# EAGLE design zap (EAGLE 6.6.0)
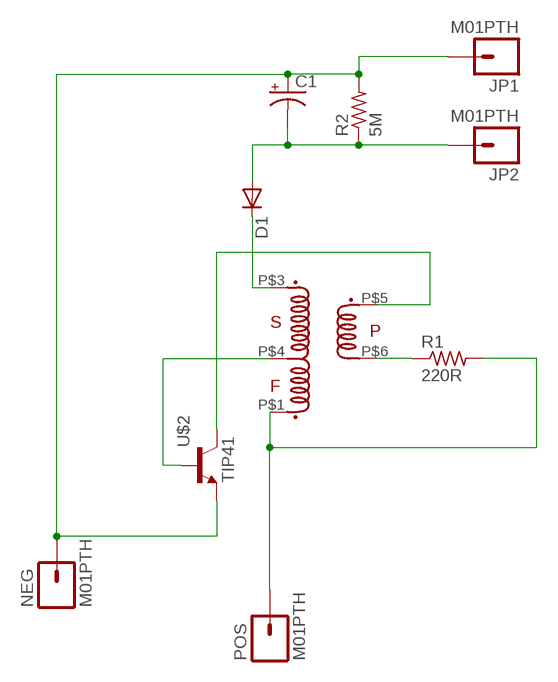
[diagram p0: schematic, sheet 1]

## Parts
C1  CAPACITOR_POL  [E5-10,5-SIDE]
D1  DIODEPTH  [DIODE-1N4001]
JP1  M01PTH  [1X01]
JP2  M01PTH  [1X01]
NEG  M01PTH  [1X01]
POS  M01PTH  [1X01]
R1  220R  RESISTOR0207/12  [0207/12]
R2  5M  RESISTOR0207/7  [0207/7]
U$1  XFT-FLYBACK3V  [XFT-FLYBACK]
U$2  TIP41  [TO220H]

## Nets
N$1: C1.P$1(+) JP1.1 NEG.1 R2.2 U$2.3(E)
N$2: C1.P$2(-) D1.A JP2.1 R2.1
N$3: D1.C U$1.P$3(P$1.S)
N$4: R1.1 U$1.P$6(P$5.P2)
N$5: POS.1 R1.2 U$1.P$1(P$3.F)
N$7: U$1.P$4(P$2.CENTRE) U$2.1(B)
N$8: U$1.P$5(P$4.P1) U$2.2(C)

## Library data of the parts
C1 = iStivi - RCLD:CAPACITOR_POL: POLARIZED CAPACITOR, American symbol
D1 = iStivi - RCLD:DIODE: Diode These are standard reverse protection diodes and small signal diodes.
JP1 JP2 NEG POS = iStivi - Header-Connector:M01: Header 1 Standard 1-pin 0.1" header. Use with straight break away headers (SKU : PRT-00116), right angle break away headers (PRT-00553), swiss pins (PRT-00743), machine pins (PRT-00117), and female headers (PRT-00115).
R1 R2 = iStivi - RCLD:RESISTOR: RESISTOR
U$1 = iStivi - Transformers:XFT-FLYBACK: XFT Flyback transformer
U$2 = iStivi - Transistor-FET-reg:TIP41: TIP41 NPN power transistor

## Board
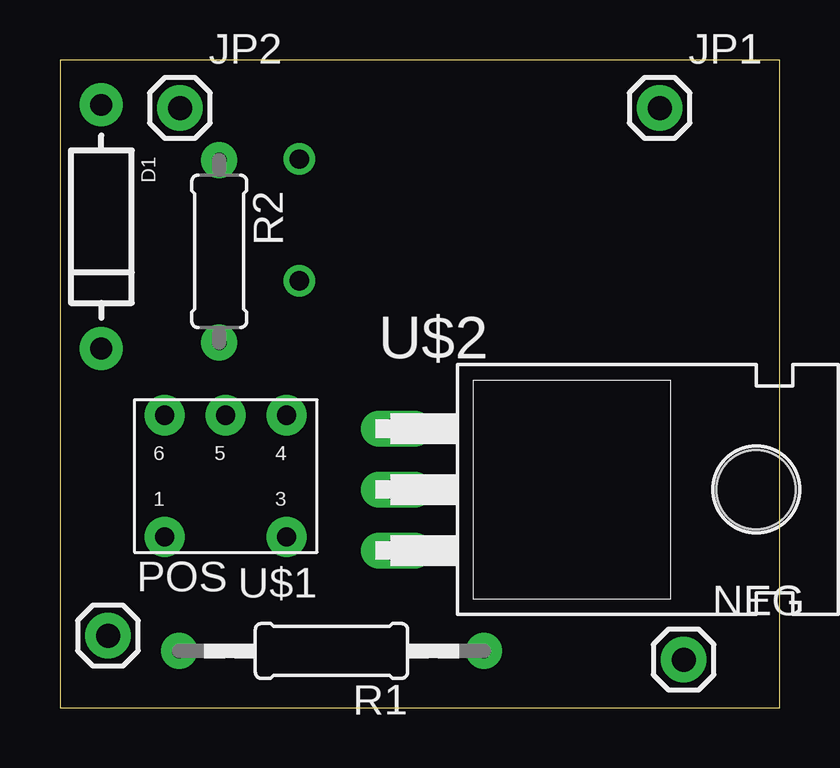
[diagram p1: board, top side]
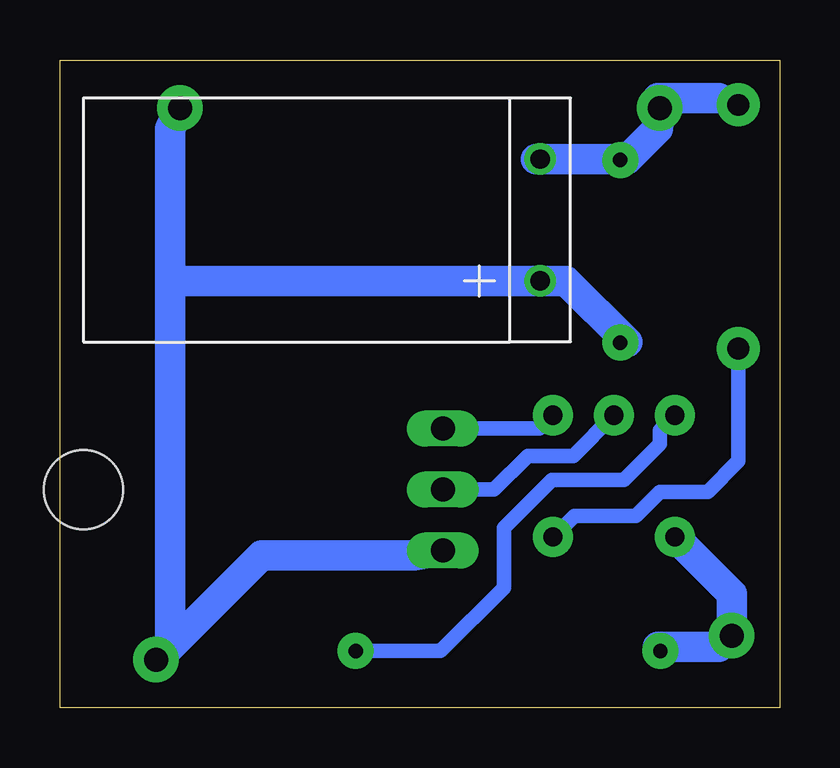
[diagram p2: board, bottom side, seen from below]

Size 30 x 27 mm. Coordinates in mm from the lower left corner, seen from the top.
Outline: 0,0 30,0 30,27 0,27 0,0
Copper layers (1*16): Top 0.035mm / dielectric 1.5mm / Bottom 0.035mm
Design rules "zap *": minimum track width 10mil, minimum drill 0.6mm, track to track 0.205mm, track to pad 0.205mm, pad to pad 0.205mm, via to via 0.205mm, smd to smd 8mil, copper to edge 0.3mm, drill to drill 8mil, minimum pad ring 10mil, minimum via ring 8mil, stop-mask expansion 4mil, vias tented up to drill 0mil, thermal gap 10mil

### Footprints (pad centres in the part's own frame; a part is rotated, then mirrored left to right if it is on the bottom)
E5-10,5-SIDE = drill 0.8: P$1 0,2.54; P$2 0,-2.54
DIODE-1N4001 = drill 0.9 pad 1.8: A -5.08,0; C 5.08,0
1X01 = drill 1 pad 1.88: 1 0,0
0207/12 = drill 0.6 pad 1.5: 1 -6.35,0; 2 6.35,0
0207/7 = drill 0.6 pad 1.5: 1 -3.81,0; 2 3.81,0
XFT-FLYBACK = drill 0.8 pad 1.676: P$1 2.54,2.54; P$3 -2.54,2.54; P$4 -2.54,-2.54; P$5 0,-2.54; P$6 2.54,-2.54
TO220H = drill 1 long: 1 -2.54,-10.16; 2 0,-10.16; 3 2.54,-10.16 | hole 3.302: 0,4.826

### Placement (x,y rotation side)
C1  9.98,20.33 180 bottom
D1  1.72,20.05 270 top
JP1  25,25 0 top
JP2  5,25 0 top
NEG  26,2 0 top
POS  2,3 0 top
R1  11.32,2.36 180 top
R2  6.64,19.02 270 top
U$1  6.91,9.65 180 top
U$2  24.2,9.09 270 top

### Tracks (layer width: path | path; a pad name or v marks a point on that pad's centre or on a via)
N$1
  Bottom 0.254: 10.16,17.78 C1.P$1
  Bottom 1.27: R2.2 6.35,15.24 8.9,17.79 C1.P$1 | 25.4,2.54 21.59,6.35 15.24,6.35 U$2.3 | 25.4,2.54 25.4,17.78 | 25.4,17.78 25.4,24.13 JP1.1 | 25.4,2.54 NEG.1 | 25.4,17.78 10.16,17.78
N$2
  Bottom 0.254: 10.16,22.86 C1.P$2 | 5.08,25.4 JP2.1 | 6.35,22.86 R2.1
  Bottom 1.27: 10.16,22.86 6.35,22.86 5.08,24.13 JP2.1 | 5.08,25.4 2.54,25.4 D1.A
N$3
  Bottom 0.61: U$1.P$3 8.56,8 6,8 5,9 3,9 1.72,10.28 D1.C
N$4
  Bottom 0.61: U$1.P$6 5,11.56 5,11 6.5,9.5 9.5,9.5 11.5,7.5 11.5,5 14.14,2.36 R1.1
N$5
  Bottom 1.27: R1.2 5.08,2.54 2.54,2.54 POS.1 2,4.74 U$1.P$1
N$7
  Bottom 0.61: U$1.P$4 10.01,11.63 U$2.1
N$8
  Bottom 0.61: U$1.P$5 8.6,10.5 10.5,10.5 11.91,9.09 U$2.2